# EasyEDA Pro project pcb饭卡.epro

# Board PCB_CKCHEN_NFC_PCB_2024-08-18
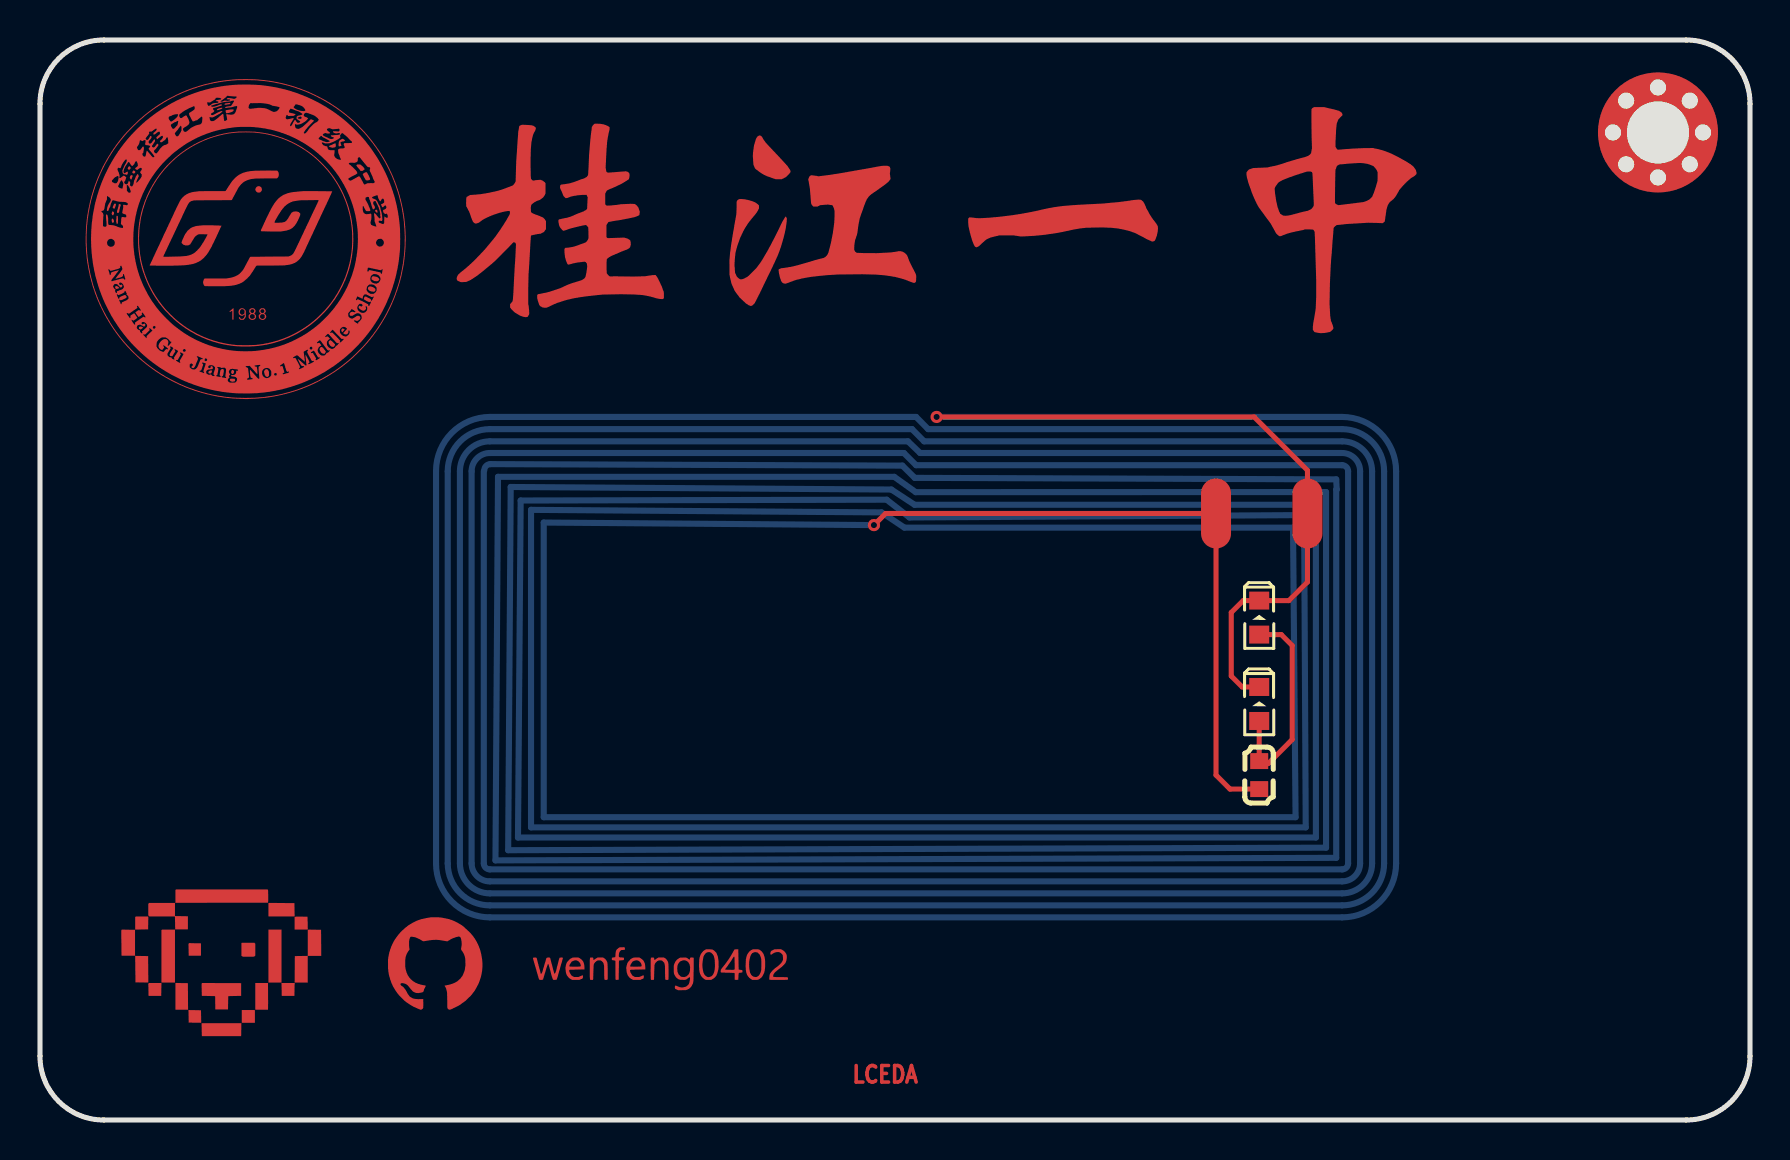
[diagram p0: board, top side]
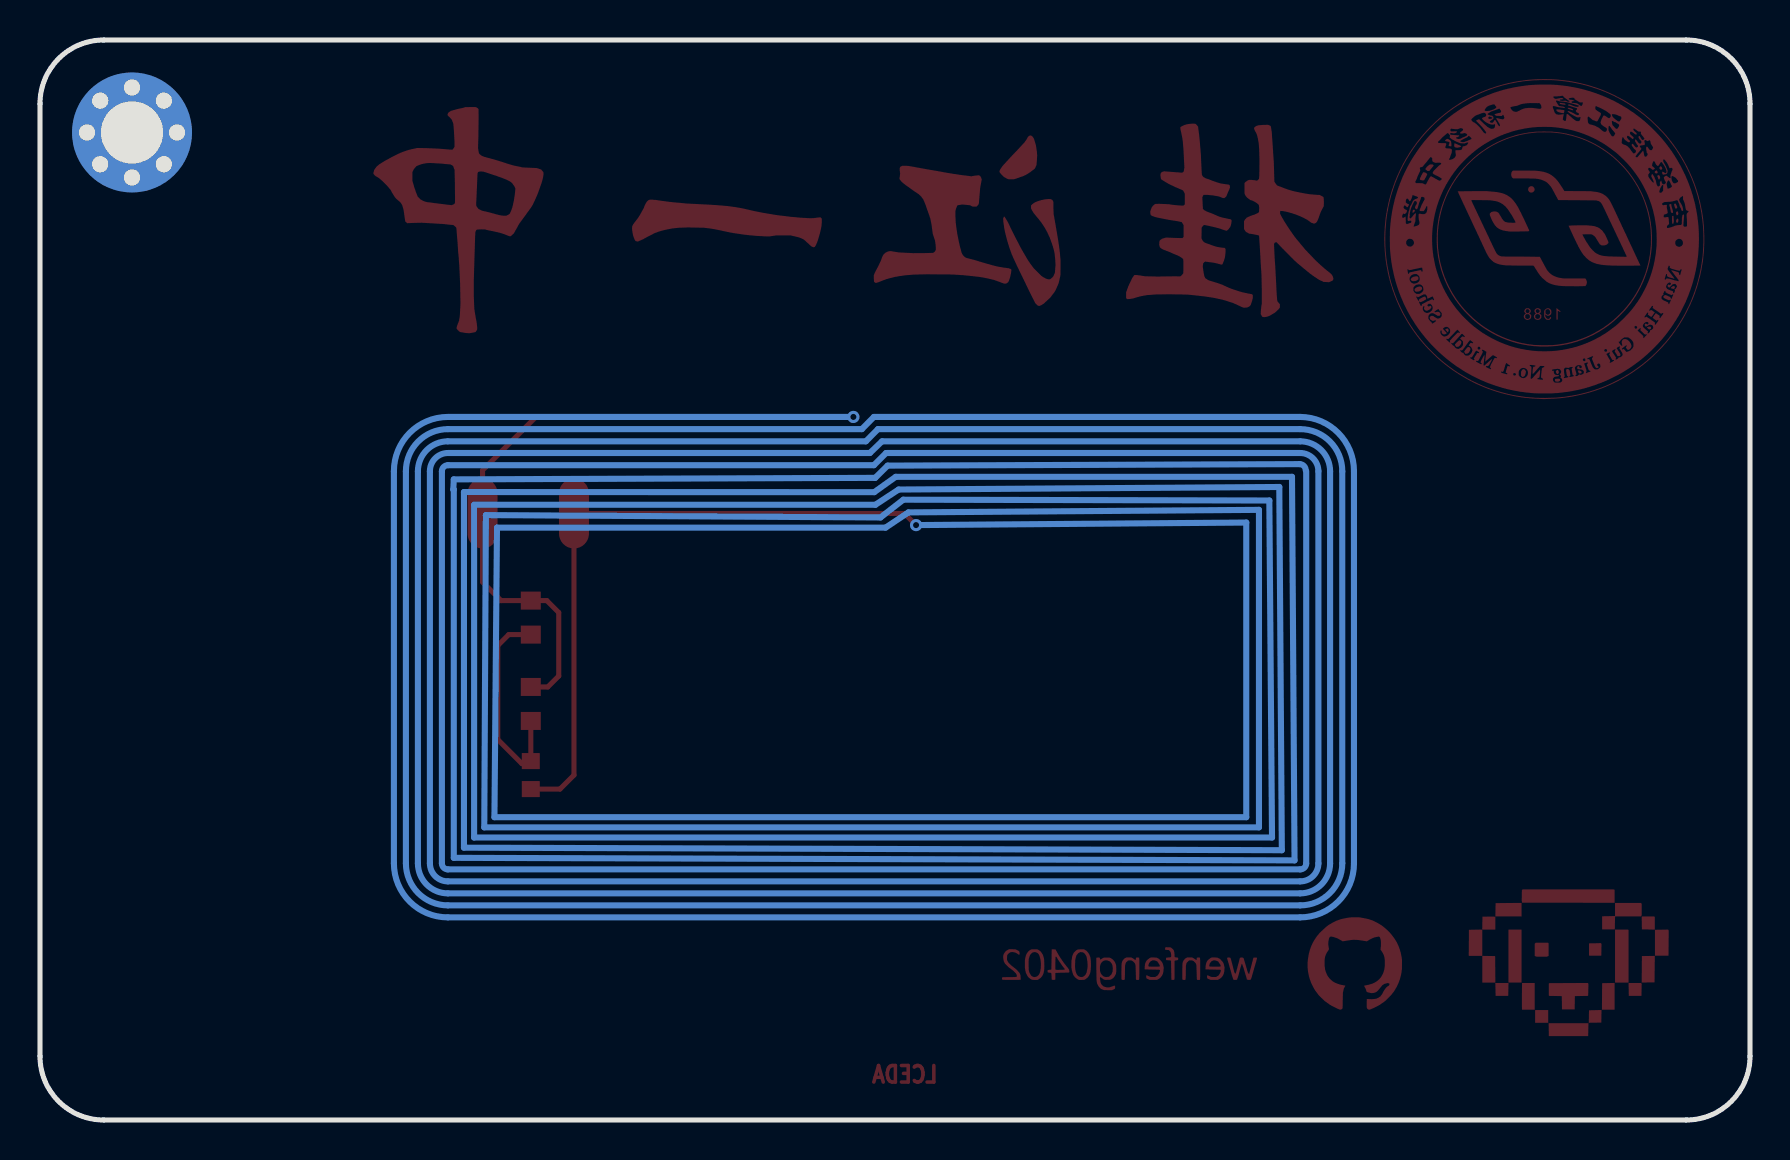
[diagram p1: board, bottom side, seen from below]

Outline 85.5 x 54 mm; copper layers: Top Layer, Bottom Layer. Coordinates in mm from the lower left corner of the outline.
Outline path: 0,50.82 arc(0.93,53.07) 3.18,54 82.32,54 arc(84.57,53.07) 85.5,50.82 85.5,3.18 arc(84.57,0.93) 82.32,0 3.18,0 arc(0.93,0.93) 0,3.18 0,50.82
Stack: Top Layer 0.035mm / Dielectric1 1.51mm FR4 er 4.5 / Bottom Layer 0.035mm

## Design rules (mm)
spacing Default (default): track to track 0.152, other pairs 0 to 0.152
track width Default (default): min 0.254, default 0.254, max 25.4
differential pair differentialPair (default): width min 0.127, default 0.254, max 2.54; gap min 0.152, default 0.152
via Default (default): diameter min 0.61, default 0.61, max 100.025; hole min 0.305, default 0.305, max 59.995

## Placement (name value [footprint] x y rotation side)
C2  220nF  [C0603]  60.96 17.25 90 top
LED3  TJ-S1005SW4TGLC2R-A5  [LED0603_RED]  60.96 25.12 90 top
LED4  TJ-S1005SW4TGLC2R-A5  [LED0603_RED]  60.96 20.8 90 top
M5  M3固定柱  [M3螺丝孔外直径6MM-带8小孔]  80.9 49.38 0 top
NOREF  -  [Pad_e109]  63.37 30.33 180 top
NOREF#2  -  [Pad_e108]  58.8 30.33 180 top

## Footprints (pads in the part's own frame, mm; a bottom-side part is the same pattern mirrored in y, then rotated)
C0603
  rect 0.8x0.9 smd: 1(-0.7,0) 2(0.7,0)
LED0603_RED
  rect 0.9x1 smd: 1(-0.85,0) 2(0.85,0)
M3螺丝孔外直径6MM-带8小孔
  round 0.8 hole 0.8: 1(-2.25,0) 1(-1.591,1.591) 1(-1.591,-1.591) 1(0,2.25) 1(0,-2.25) 1(1.591,1.591) 1(1.591,-1.591) 1(2.25,0)
  round 6 hole 3.1: 1(0,0)
Pad_e108
  oval 1.5x3.5 smd: 1(0,0)
Pad_e109
  oval 1.5x3.5 smd: 1(0,0)

## Nets
GND: C2.1 LED3.1 LED3.2 LED4.1 LED4.2 NOREF.1 NOREF#2.1
VCC: C2.2

Pads without a net: M5 1

## Via types
v1: diameter 0.61, hole 0.305, Top Layer to Bottom Layer, 2 vias

## Routing (per net, layer and track width the routed paths; a pad name or vN(x,y) marks a point on that pad's centre or on a via; arc(x,y) is an arc through that point)
GND: length 1265.5
  Top Layer w0.254: 60.83,25.97 60.16,25.97 59.56,25.37 59.56,22.2 60.11,21.65 LED4.2 ; LED3.2 62.44,25.97 63.37,26.9 NOREF.1 63.37,32.49 60.71,35.15 v1(44.83,35.15) ; C2.1 59.5,16.55 58.8,17.25 NOREF#2.1 42.28,30.33 v1(41.7,29.75) ; LED3.1 62.06,24.27 62.61,23.72 62.61,19.02 61.41,17.82 60.83,17.82 60.96,17.95 LED4.1
  Bottom Layer w0.305: 65.1,34.54 44.41,34.54 43.81,35.15 22.49,35.15 ; 67.81,12.83 67.81,32.44 ; 66,12.83 66,32.44 ; 65.1,32.74 43.81,32.74 43.19,33.35 22.49,33.35 ; 65.41,12.83 65.41,32.44 ; 22.49,33.93 43.4,33.93 44,33.35 65.1,33.35 ; v1(41.7,29.75) 25.19,29.87 25.19,15.14 62.78,15.14 62.65,29.62 43.22,29.62 42.08,30.38 24.55,30.51 24.55,14.63 63.29,14.63 63.21,30.25 43.47,30.13 42.33,31.02 24.03,30.97 23.9,14.12 63.79,14.12 63.79,30.76 43.73,30.76 42.57,31.52 23.54,31.65 23.41,13.49 64.3,13.62 64.3,31.4 43.79,31.39 42.71,32.16 22.9,32.16 22.77,12.98 64.81,13.11 64.81,31.52 64.84,31.53 64.81,32.03 43.74,32.11 43.12,32.72 22.52,32.79 ; 22.49,11.93 65.1,11.93 ; 22.49,12.53 65.1,12.53 ; 65.1,33.93 44.21,33.93 43.6,34.54 22.49,34.54 ; 21.58,12.83 21.58,32.44 ; 22.49,11.33 65.1,11.33 ; 22.19,12.83 22.19,32.44 ; 19.8,12.83 19.8,32.44 ; 65.11,35.15 v1(44.83,35.15) ; 22.49,10.73 65.1,10.73 ; 66.6,12.83 66.6,32.44 ; 20.39,12.83 20.39,32.44 ; 22.49,10.13 65.1,10.13 ; 21,12.83 21,32.44 ; 67.21,12.83 67.21,32.44

Small or netless copper shapes (teardrops, artwork), in the pictures only: 76 on Top Layer

## Text on the board
Top Layer: LCEDA
